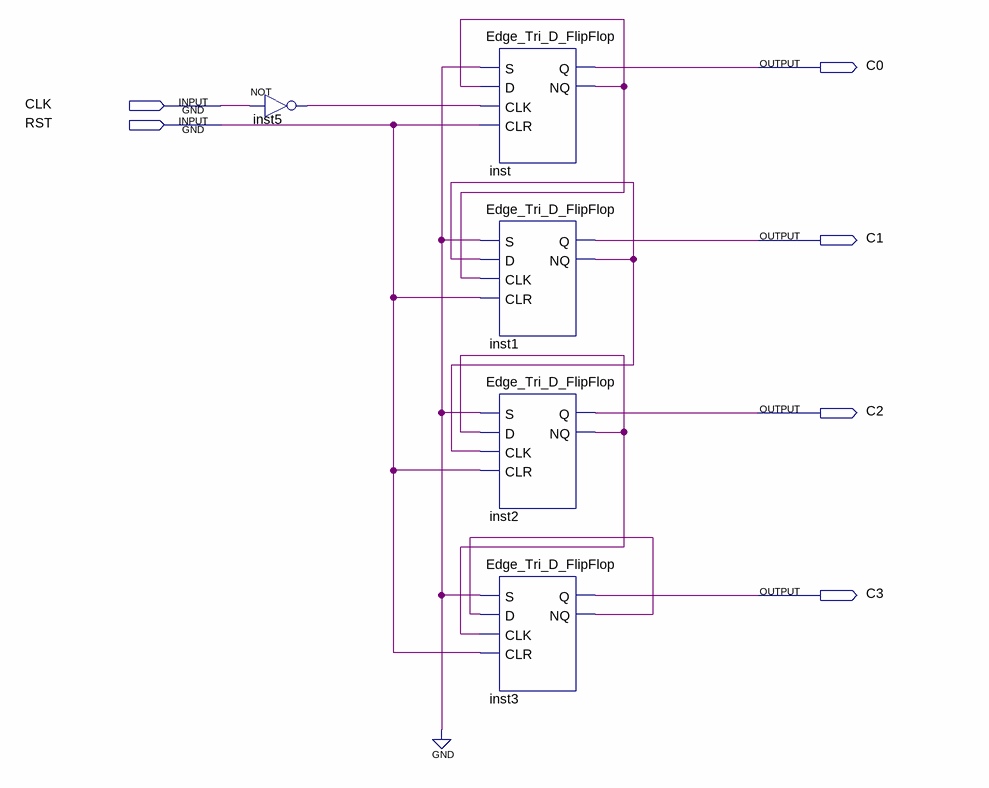
[diagram p0: schematic sheet]
// Quartus schematic MicroInstructionCounter.bdf as structural Verilog: 5 symbols, 6 pins
module MicroInstructionCounter (
  input  CLK,
  input  RST,
  output C0,
  output C1,
  output C2,
  output C3
);

  wire inst1_nq, inst2_nq, inst3_nq, inst5_out, inst_nq;

  not inst5 (inst5_out, CLK);
  Edge_Tri_D_FlipFlop inst (.S(1'b0), .D(inst_nq), .CLK(inst5_out), .CLR(RST), .Q(C0), .NQ(inst_nq));
  Edge_Tri_D_FlipFlop inst1 (.S(1'b0), .D(inst1_nq), .CLK(inst_nq), .CLR(RST), .Q(C1), .NQ(inst1_nq));
  Edge_Tri_D_FlipFlop inst2 (.S(1'b0), .D(inst2_nq), .CLK(inst1_nq), .CLR(RST), .Q(C2), .NQ(inst2_nq));
  Edge_Tri_D_FlipFlop inst3 (.S(1'b0), .D(inst3_nq), .CLK(inst2_nq), .CLR(RST), .Q(C3), .NQ(inst3_nq));
endmodule
